# Altium schematic sheet Copy of connectors.SchDoc
size A4
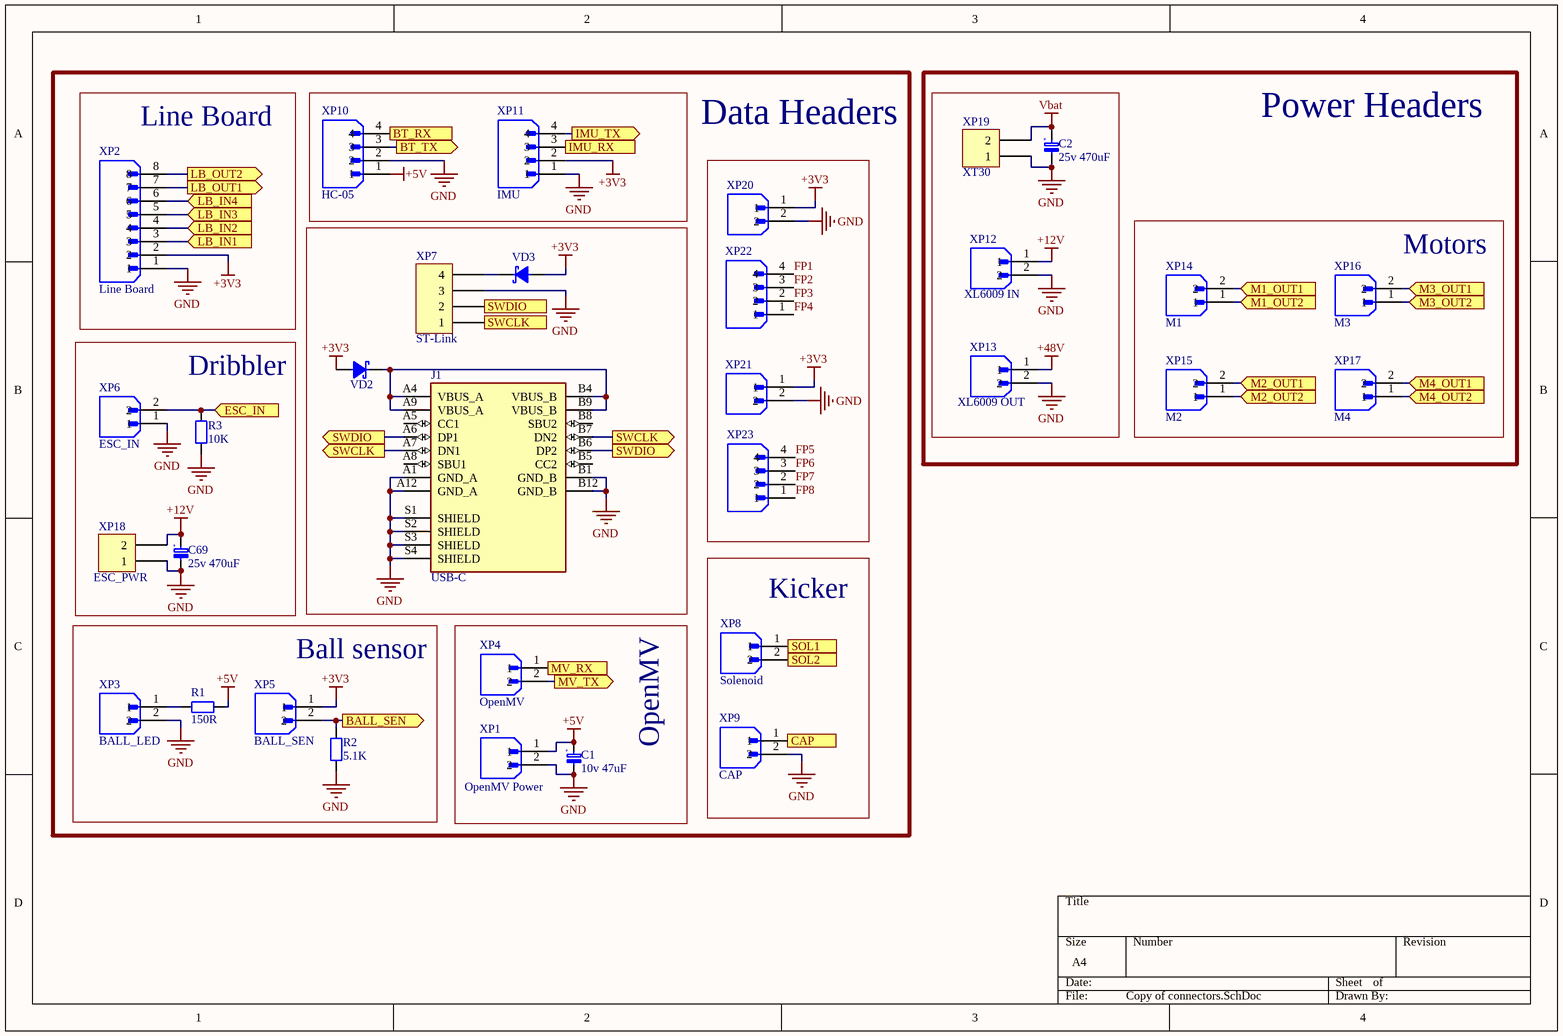
[diagram p0: Copy of connectors.SchDoc]

## Parts
C1  10v 47uF  [CAP_TANT_D]
C2  25v 470uF  [D8C3.5H12]
C69  25v 470uF  [D8C3.5H12]
J1  USB-C
R1  150R  [RES0805]
R2  5.1K  [RES0805]
R3  10K  [RES0805]
VD2  Diode Schottky  [DO-214AC]  (value not drawn)
VD3  Diode Schottky  [DO-214AC]  (value not drawn)
XP1  OpenMV Power  [JST_XH-2]
XP2  Line Board  [JST_XH-8]
XP3  BALL_LED  [JST_XH-2]
XP4  OpenMV  [JST_XH-2]
XP5  BALL_SEN  [JST_XH-2]
XP6  ESC_IN  [JST_XH-2]
XP7  ST-Link  [4x2.54]
XP8  Solenoid  [JST_XH-2]
XP9  CAP  [JST_XH-2]
XP10  HC-05  [JST_XH-4]
XP11  IMU  [JST_XH-4]
XP12  XL6009 IN  [JST_XH-2]
XP13  XL6009 OUT  [JST_XH-2]
XP14  M1  [JST_XH-2]
XP15  M2  [JST_XH-2]
XP16  M3  [JST_XH-2]
XP17  M4  [JST_XH-2]
XP18  ESC_PWR  [XT30_3D]
XP19  XT30  [XT30_3D]
XP20  PWR  [JST_XH-2]  (value not drawn)
XP21  OpenMV  [JST_XH-2]  (value not drawn)
XP22  HC-05  [JST_XH-4]  (value not drawn)
XP23  HC-05  [JST_XH-4]  (value not drawn)

## Blocks framed on the sheet
Data Headers: J1 VD2 VD3 XP7 XP10 XP11 XP20-XP23
Power Headers: C2 XP12 XP13 XP19
Line Board: XP2
Motors: XP14-XP17
Dribbler: C69 R3 XP6 XP18
Kicker: XP8 XP9
Ball sensor: R1 R2 XP3 XP5
OpenMV: C1 XP1 XP4

## Ports
BALL_SEN (out), BT_RX (in), BT_TX (out), CAP (in), ESC_IN (in), IMU_RX (in), IMU_TX (out), LB_IN1 (in), LB_IN2 (in), LB_IN3 (in), LB_IN4 (in), LB_OUT1 (out), LB_OUT2 (out), M1_OUT1 (in), M1_OUT2 (in), M2_OUT1 (in), M2_OUT2 (in), M3_OUT1 (in), M3_OUT2 (in), M4_OUT1 (in), M4_OUT2 (in), MV_RX (in), MV_TX (out), SOL1 (in), SOL2 (in), SWCLK (out), SWDIO (out)

## Nets
+3V3: VD2.2(A) VD3.2(A) XP2.2 XP5.1 XP11.2 XP20.1 XP21.1
+5V: C1.2(PLUS) R1.1 XP1.1 XP10.1
+12V: C69.1(PLUS) XP12.1 XP18.2
+48V: XP13.1
GND: C1.1(MINUS) C2.2(MINUS) C69.2(MINUS) J1.A1(GND_A) J1.A12(GND_A) J1.B1(GND_B) J1.B12(GND_B) J1.S1(SHIELD) J1.S2(SHIELD) J1.S3(SHIELD) J1.S4(SHIELD) R2.1 R3.1 XP1.2 XP2.1 XP3.2 XP6.1 XP7.3 XP9.2 XP10.2 XP11.1 XP12.2 XP13.2 XP18.1 XP19.1 XP20.2 XP21.2
Vbat: C2.1(PLUS) XP19.2
BALL_SEN: R2.2 XP5.2 ; port BALL_SEN
BT_RX: XP10.4 ; port BT_RX
BT_TX: XP10.3 ; port BT_TX
CAP: XP9.1 ; port CAP
ESC_IN: R3.2 XP6.2 ; port ESC_IN
FP1: XP22.4
FP2: XP22.3
FP3: XP22.2
FP4: XP22.1
FP5: XP23.4
FP6: XP23.3
FP7: XP23.2
FP8: XP23.1
IMU_RX: XP11.3 ; port IMU_RX
IMU_TX: XP11.4 ; port IMU_TX
LB_IN1: XP2.3 ; port LB_IN1
LB_IN2: XP2.4 ; port LB_IN2
LB_IN3: XP2.5 ; port LB_IN3
LB_IN4: XP2.6 ; port LB_IN4
LB_OUT1: XP2.7 ; port LB_OUT1
LB_OUT2: XP2.8 ; port LB_OUT2
M1_OUT1: XP14.2 ; port M1_OUT1
M1_OUT2: XP14.1 ; port M1_OUT2
M2_OUT1: XP15.2 ; port M2_OUT1
M2_OUT2: XP15.1 ; port M2_OUT2
M3_OUT1: XP16.2 ; port M3_OUT1
M3_OUT2: XP16.1 ; port M3_OUT2
M4_OUT1: XP17.2 ; port M4_OUT1
M4_OUT2: XP17.1 ; port M4_OUT2
MV_RX: XP4.1 ; port MV_RX
MV_TX: XP4.2 ; port MV_TX
SOL1: XP8.1 ; port SOL1
SOL2: XP8.2 ; port SOL2
SWCLK: J1.A7(DN1) J1.B7(DN2) XP7.1 ; port SWCLK
SWDIO: J1.A6(DP1) J1.B6(DP2) XP7.2 ; port SWDIO
NetJ1_A4: J1.A4(VBUS_A) J1.A9(VBUS_A) J1.B4(VBUS_B) J1.B9(VBUS_B) VD2.1(K)
NetR1_2: R1.2 XP3.1
NetVD3_1: VD3.1(K) XP7.4

Not connected (* = marked no-connect by the designer): J1 A5(CC1) A8(SBU1) B5(CC2) B8(SBU2)

## Notes on the sheet
- (in symbol Cap Aluminum) +
- (in symbol CAP Tantal) +

## Library data of the parts
C1 = CAP Tantal: Tantal SMD Cap
C2 C69 = Cap Aluminum
R1-R3 = RES: RES smd
XP1 XP3-XP6 XP8 XP9 XP12-XP17 XP20 XP21 = JST-XH-2: JST_B2B-XH-A(LF)(SN)
XP2 = JST-XH-8: JST_B8B-XH-A(LF)(SN)
XP7 = Header 4
XP10 XP11 XP22 XP23 = JST_XH-4: JST_B4B-XH-A(LF)(SN)
XP18 XP19 = Power connectors